# EAGLE schematic AtmegBROKE (EAGLE 6.2)
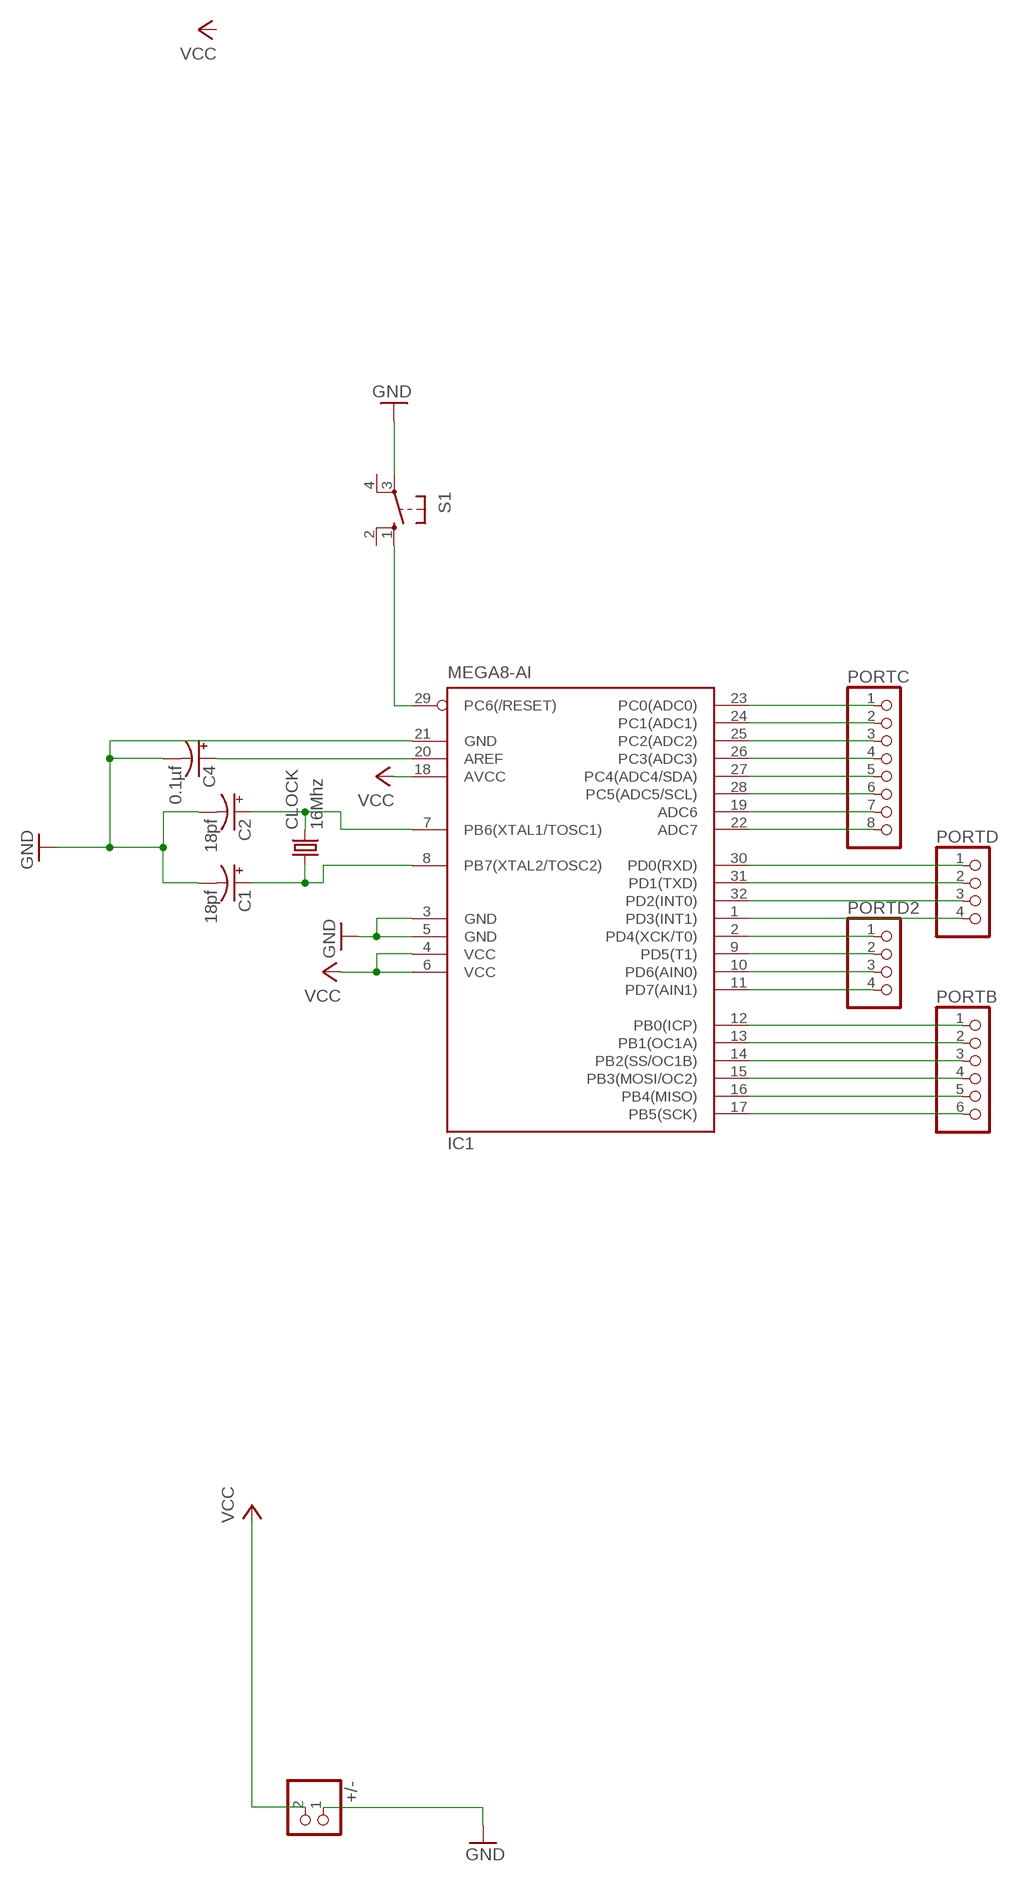
[diagram p0: schematic, sheet 1]

## Parts
+/-  PINHD-1X2  [1X02]
C1  18pf  CPOL-USSMCZ  [SMC_Z]
C2  18pf  CPOL-USSMCZ  [SMC_Z]
C4  0.1µf  CPOL-USSMCZ  [SMC_Z]
CLOCK  16Mhz  CRYSTALHC49UP  [HC49UP]
IC1  MEGA8-AI  [TQFP32-08]
PORTB  PINHD-1X6  [1X06]
PORTC  PINHD-1X8  [1X08]
PORTD  PINHD-1X4  [1X04]
PORTD2  PINHD-1X4  [1X04]
S1  10-XX  [B3F-10XX]

## Nets
GND: +/-.1 C1.- C2.- C4.- IC1.3(GND) IC1.5(GND) IC1.21(GND) S1.3(P)
N$1: C2.+ CLOCK.2 IC1.7(PB6(XTAL1/TOSC1))
N$2: IC1.29(PC6(/RESET)) S1.1(S)
N$3: IC1.30(PD0(RXD)) PORTD.1
N$5: IC1.23(PC0(ADC0)) PORTC.1
N$6: IC1.24(PC1(ADC1)) PORTC.2
N$7: C1.+ CLOCK.1 IC1.8(PB7(XTAL2/TOSC2))
N$8: IC1.25(PC2(ADC2)) PORTC.3
N$9: IC1.26(PC3(ADC3)) PORTC.4
N$10: IC1.27(PC4(ADC4/SDA)) PORTC.5
N$11: IC1.28(PC5(ADC5/SCL)) PORTC.6
N$12: IC1.19(ADC6) PORTC.7
N$13: IC1.22(ADC7) PORTC.8
N$14: IC1.31(PD1(TXD)) PORTD.2
N$15: IC1.32(PD2(INT0)) PORTD.3
N$16: IC1.1(PD3(INT1)) PORTD.4
N$17: IC1.2(PD4(XCK/T0)) PORTD2.1
N$18: IC1.9(PD5(T1)) PORTD2.2
N$19: IC1.10(PD6(AIN0)) PORTD2.3
N$20: IC1.11(PD7(AIN1)) PORTD2.4
N$22: IC1.12(PB0(ICP)) PORTB.1
N$23: IC1.13(PB1(OC1A)) PORTB.2
N$25: IC1.14(PB2(SS/OC1B)) PORTB.3
N$27: IC1.16(PB4(MISO)) PORTB.5
N$28: IC1.17(PB5(SCK)) PORTB.6
N$29: C4.+ IC1.20(AREF)
N$30: IC1.15(PB3(MOSI/OC2)) PORTB.4
VCC: +/-.2 IC1.4(VCC) IC1.6(VCC) IC1.18(AVCC)
Unconnected: S1.2(S1) S1.4(P1)

## Library data of the parts
+/- = pinhead:PINHD-1X2: PIN HEADER
C1 C2 C4 = rcl:CPOL-US: POLARIZED CAPACITOR, American symbol
CLOCK = crystal:CRYSTAL: CRYSTAL; OC_FARNELL: unknown; OC_NEWARK: unknown
IC1 = atmel:MEGA8: MICROCONTROLLER 8 Kbytes FLASH, 1 kbytes SRAM, 512 bytes EEPROM, USART, 6-channel 10 bit ADC, 2-channel 8 bit ADC Pin compatible with Atmega48, ATMega88, ATMega168 Source: avr.lbr; MPN: ATMEGA8-16AU; OC_FARNELL: 9171371; OC_NEWARK: 73M8863
PORTB = pinhead:PINHD-1X6: PIN HEADER
PORTC = pinhead:PINHD-1X8: PIN HEADER
PORTD PORTD2 = pinhead:PINHD-1X4: PIN HEADER
S1 = switch-omron:10-XX: OMRON SWITCH; MPN: B3F-1000; OC_FARNELL: 176432; OC_NEWARK: 36M3542